# EAGLE schematic PCB-CMB-6 (EAGLE 7.2.0)

## Sheet 1 of 2
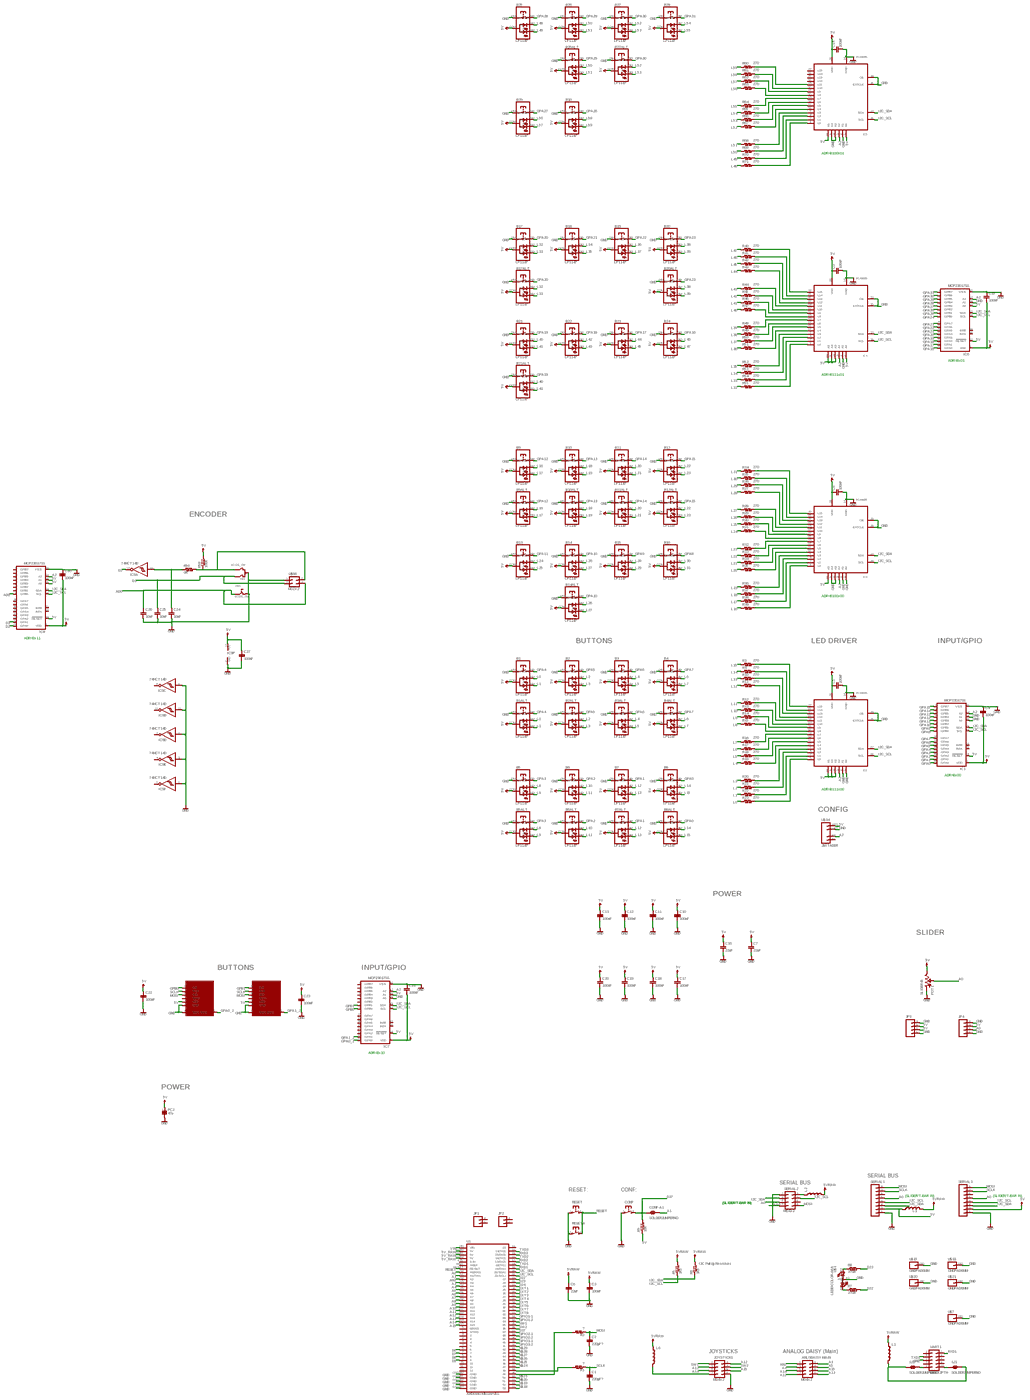
[diagram p0: schematic, sheet 1, overview]
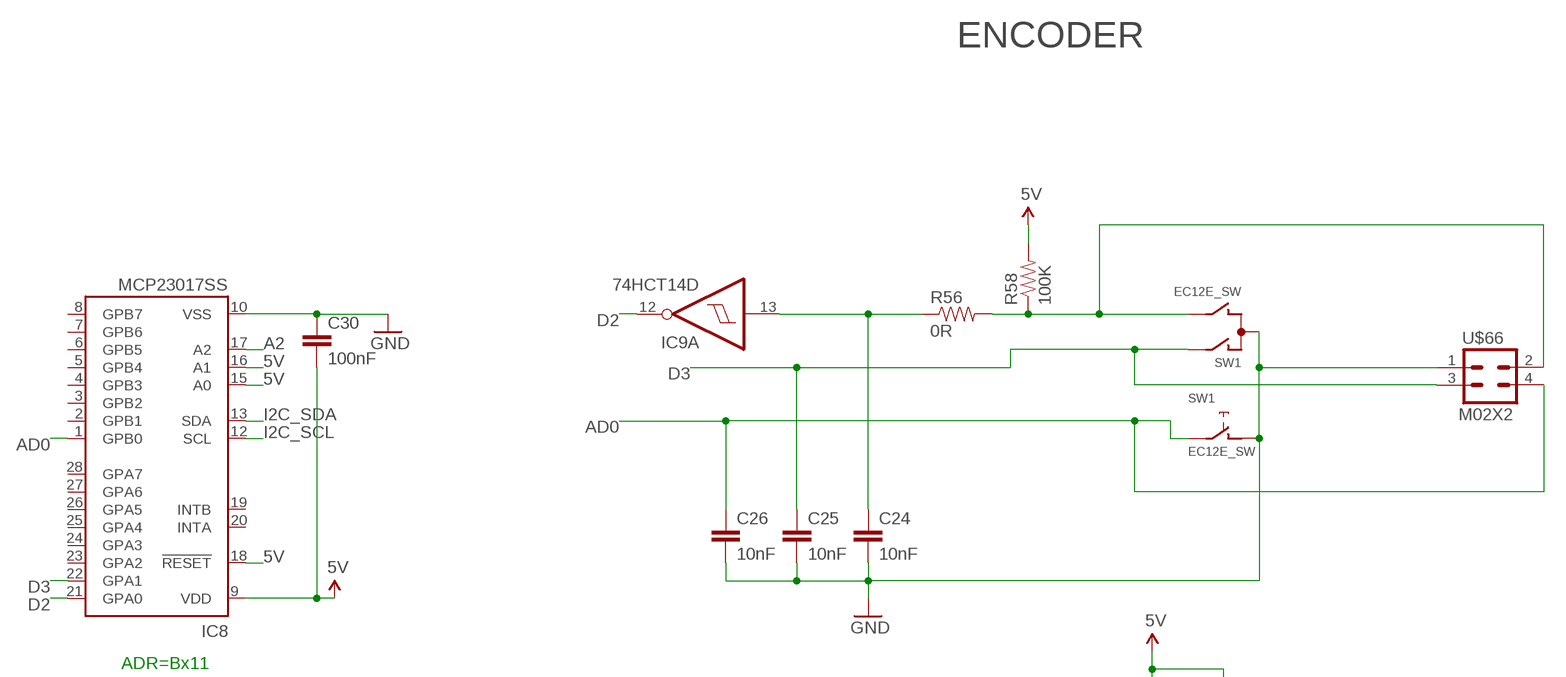
[diagram p1: schematic, sheet 1, part 1 of 6]
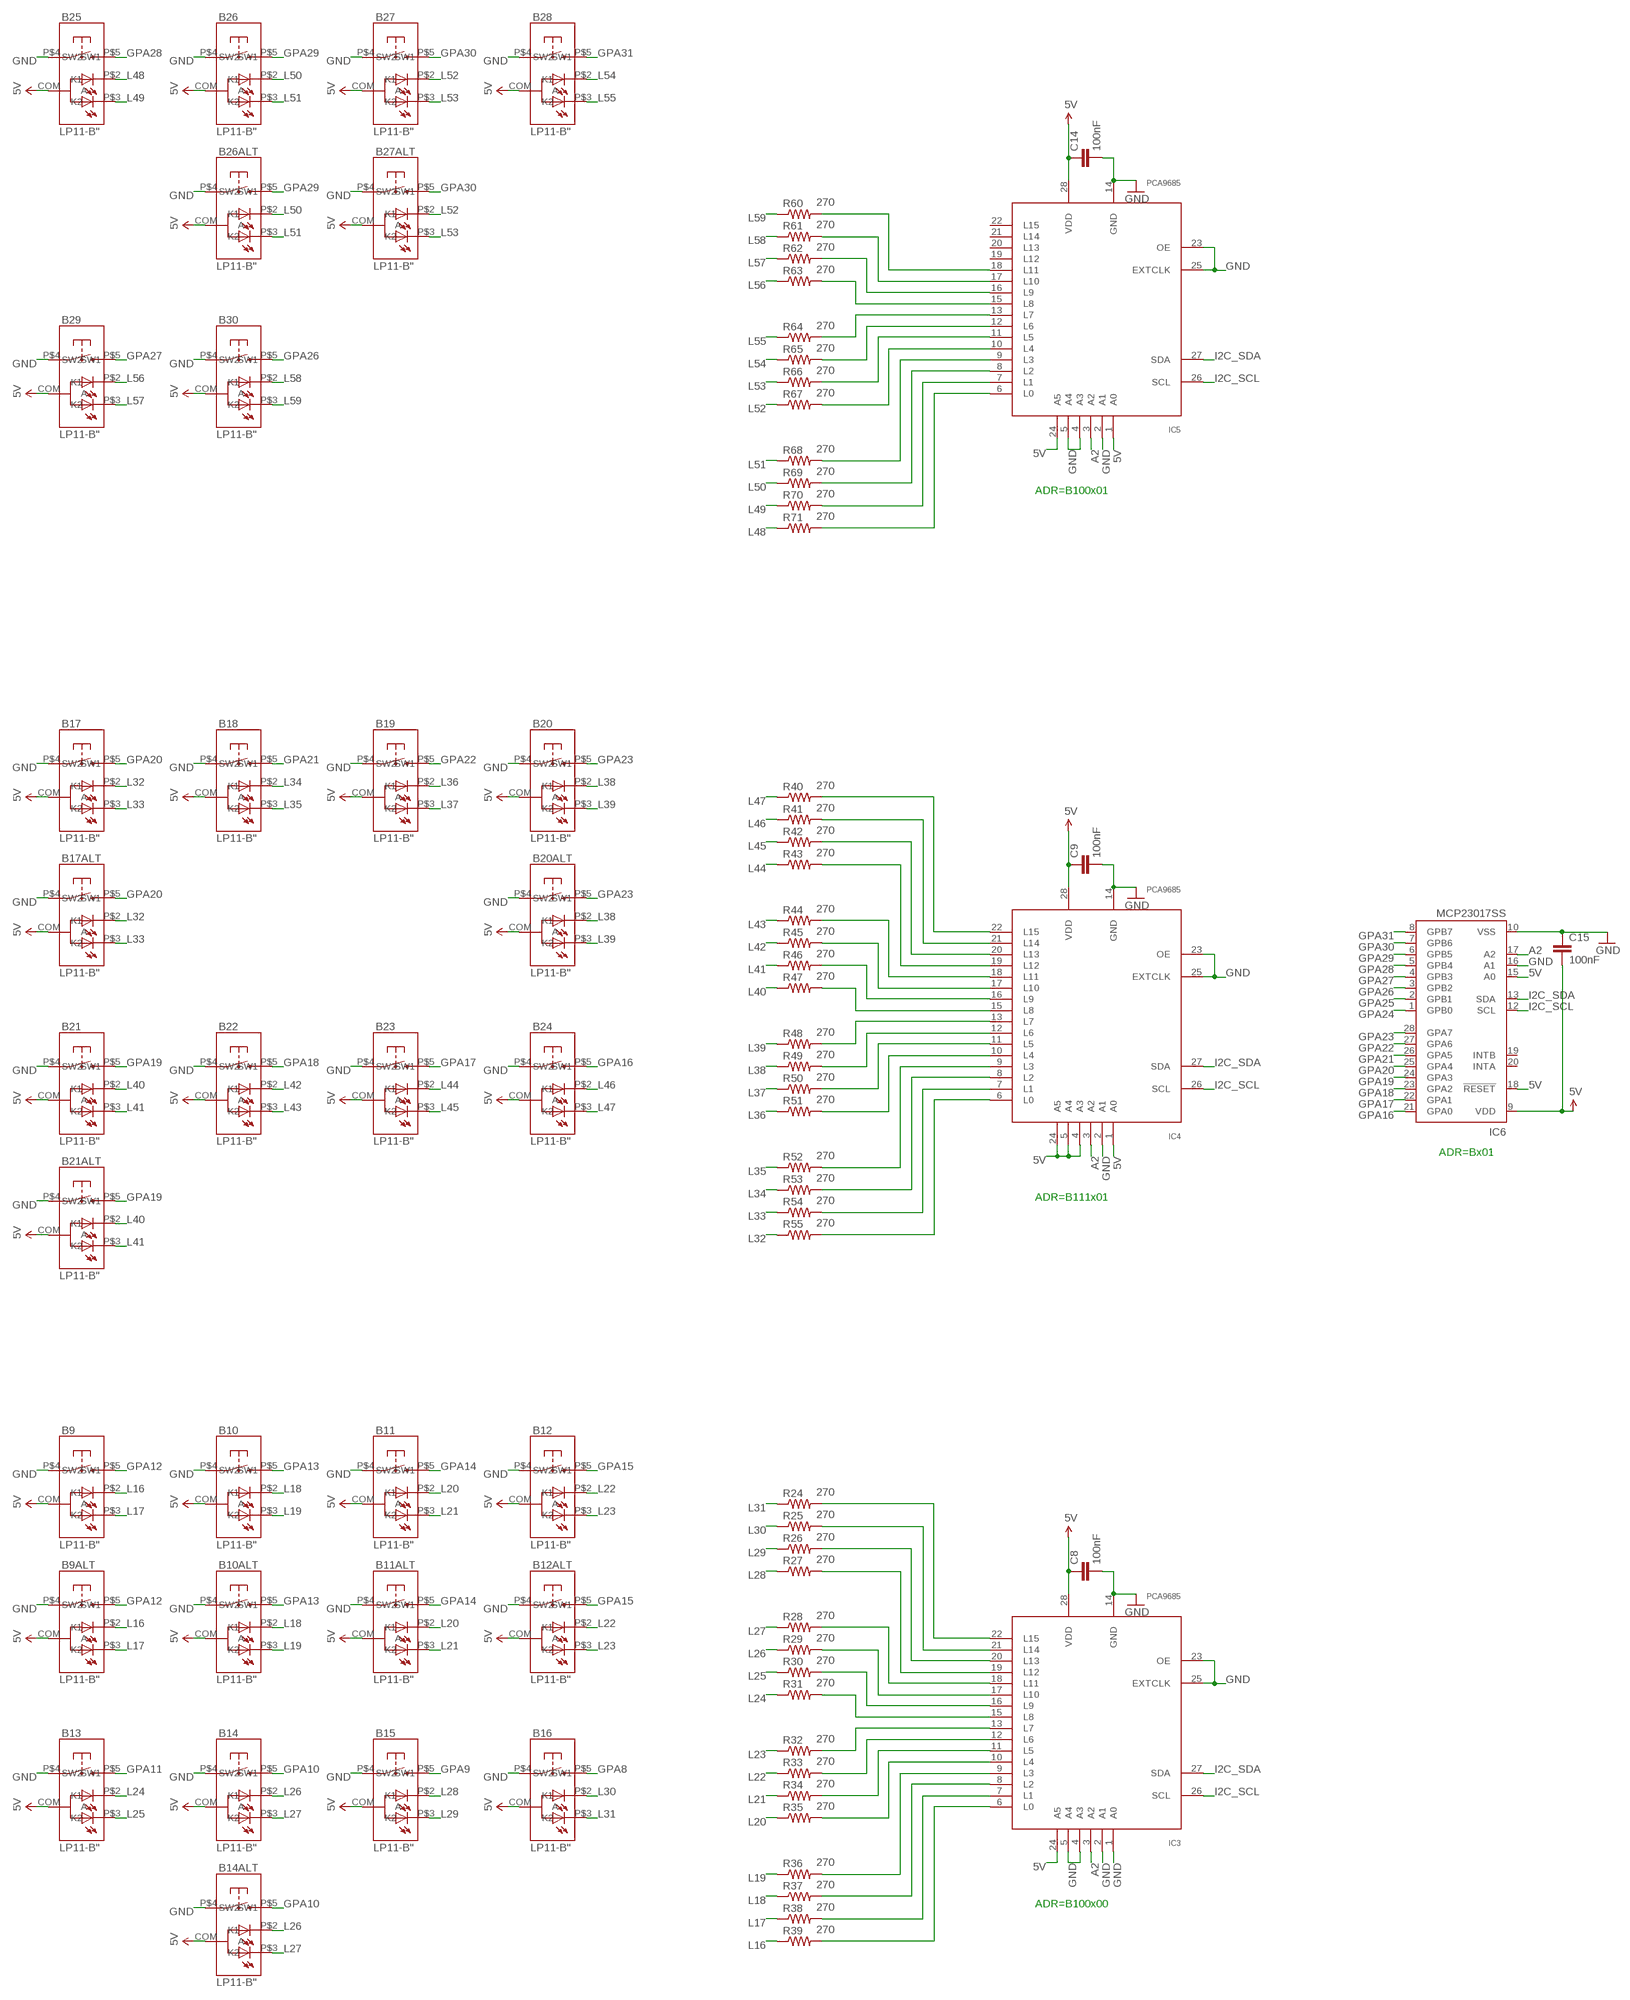
[diagram p2: schematic, sheet 1, part 2 of 6]
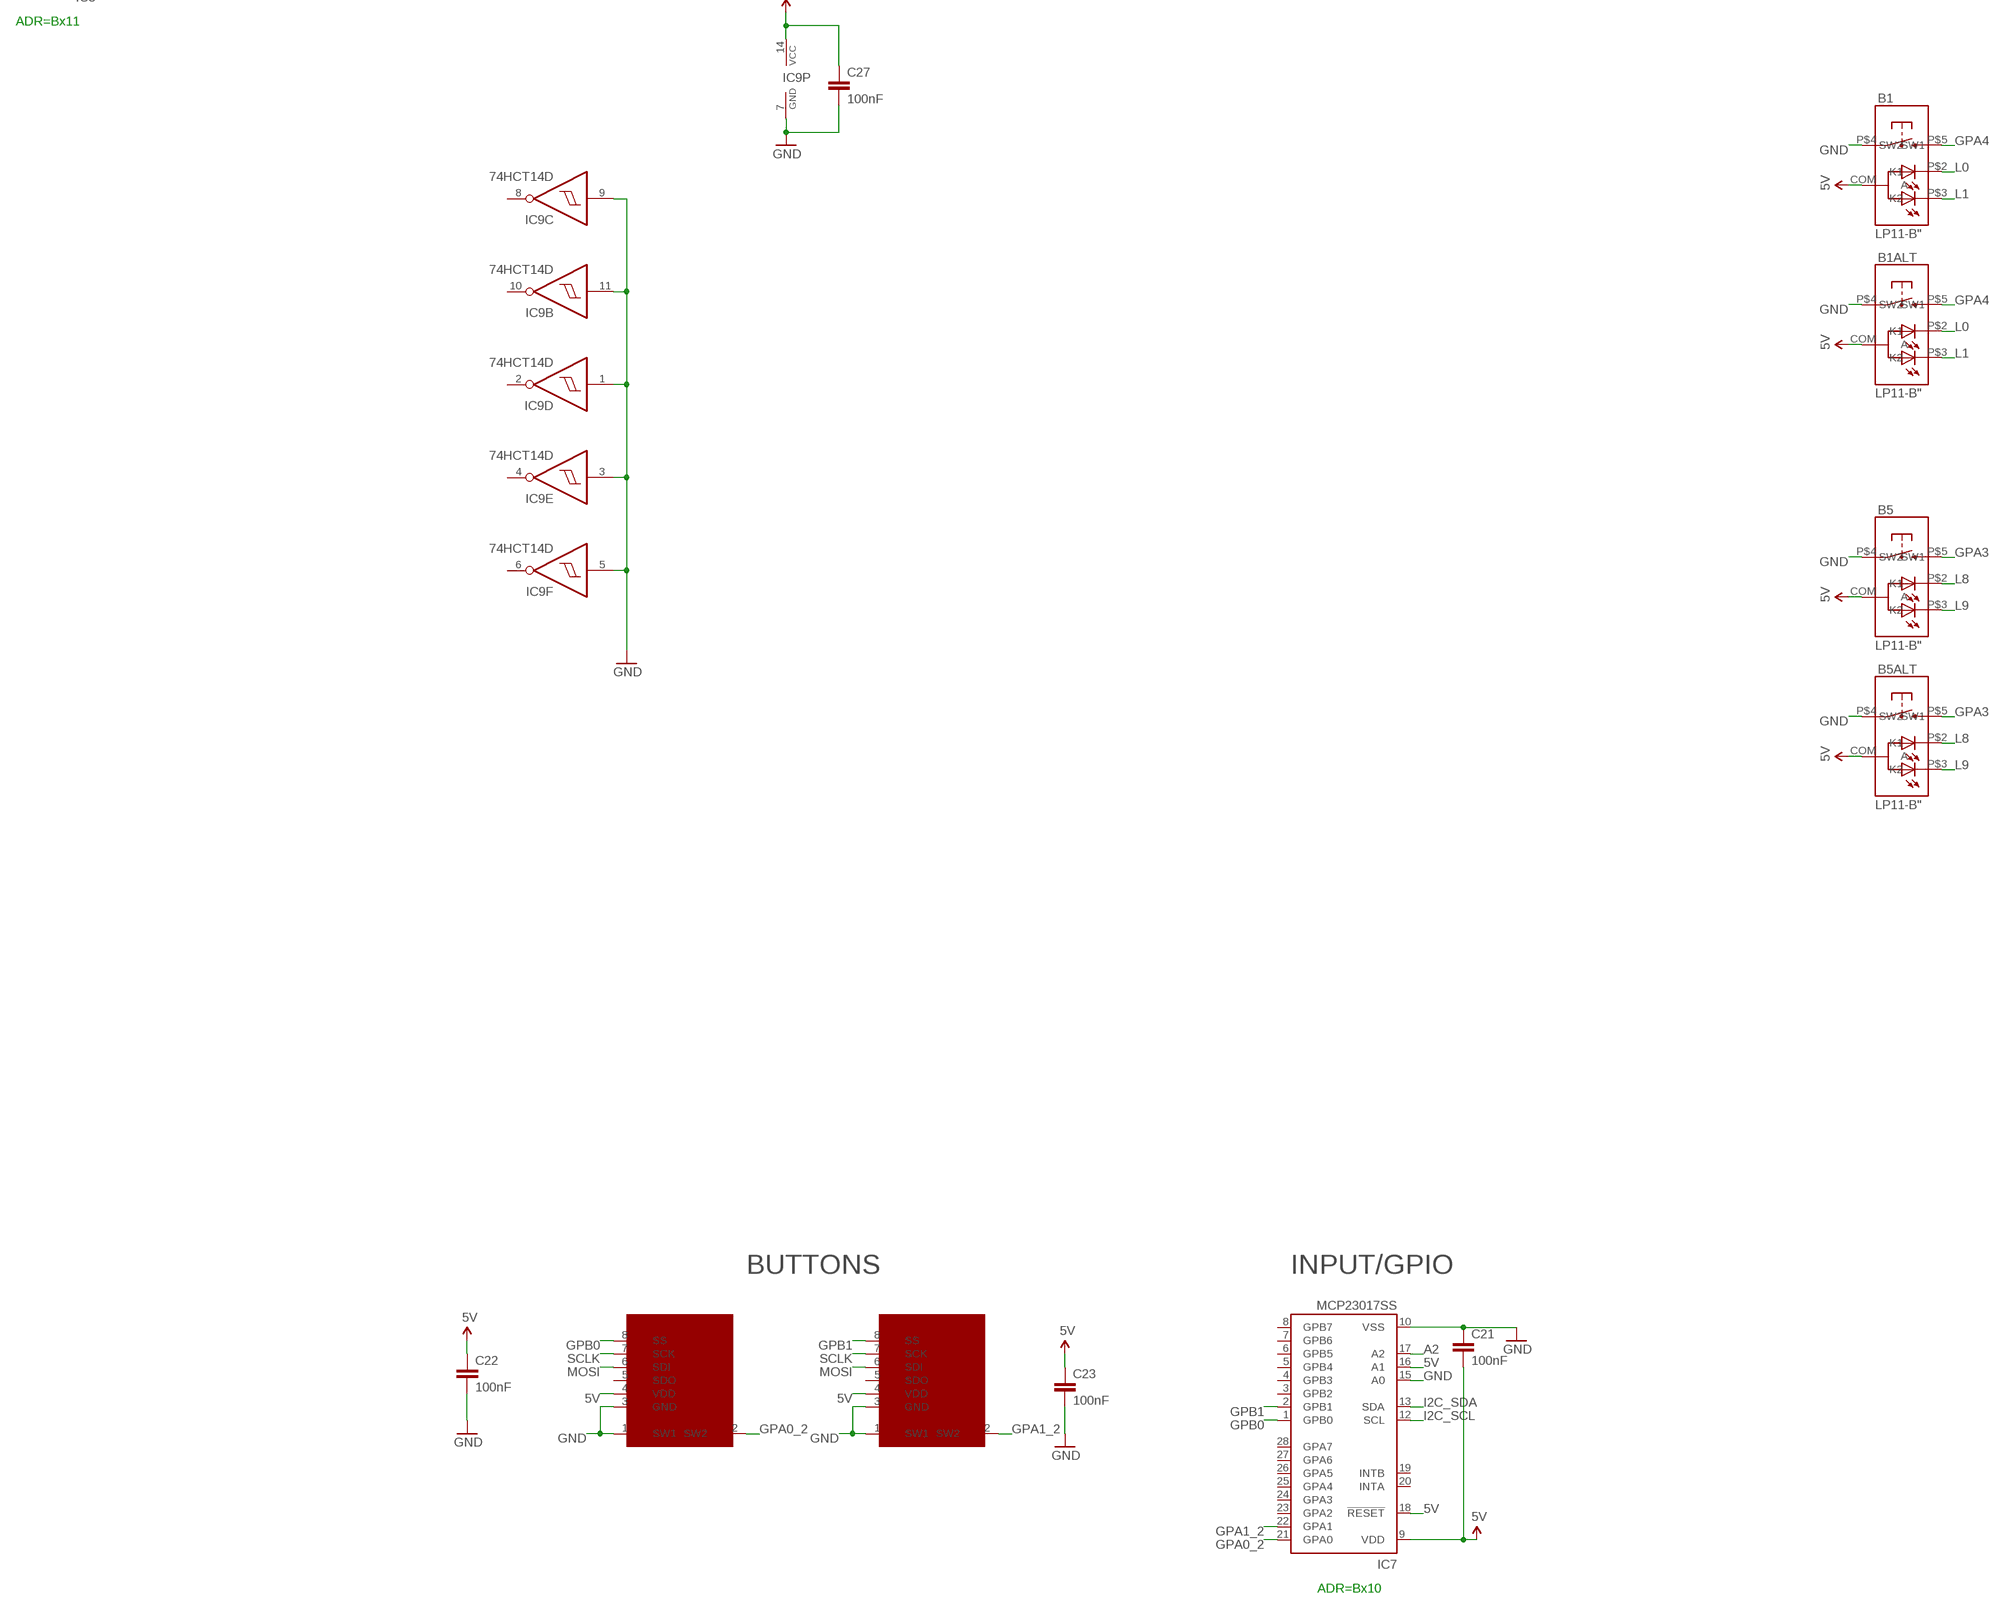
[diagram p3: schematic, sheet 1, part 3 of 6]
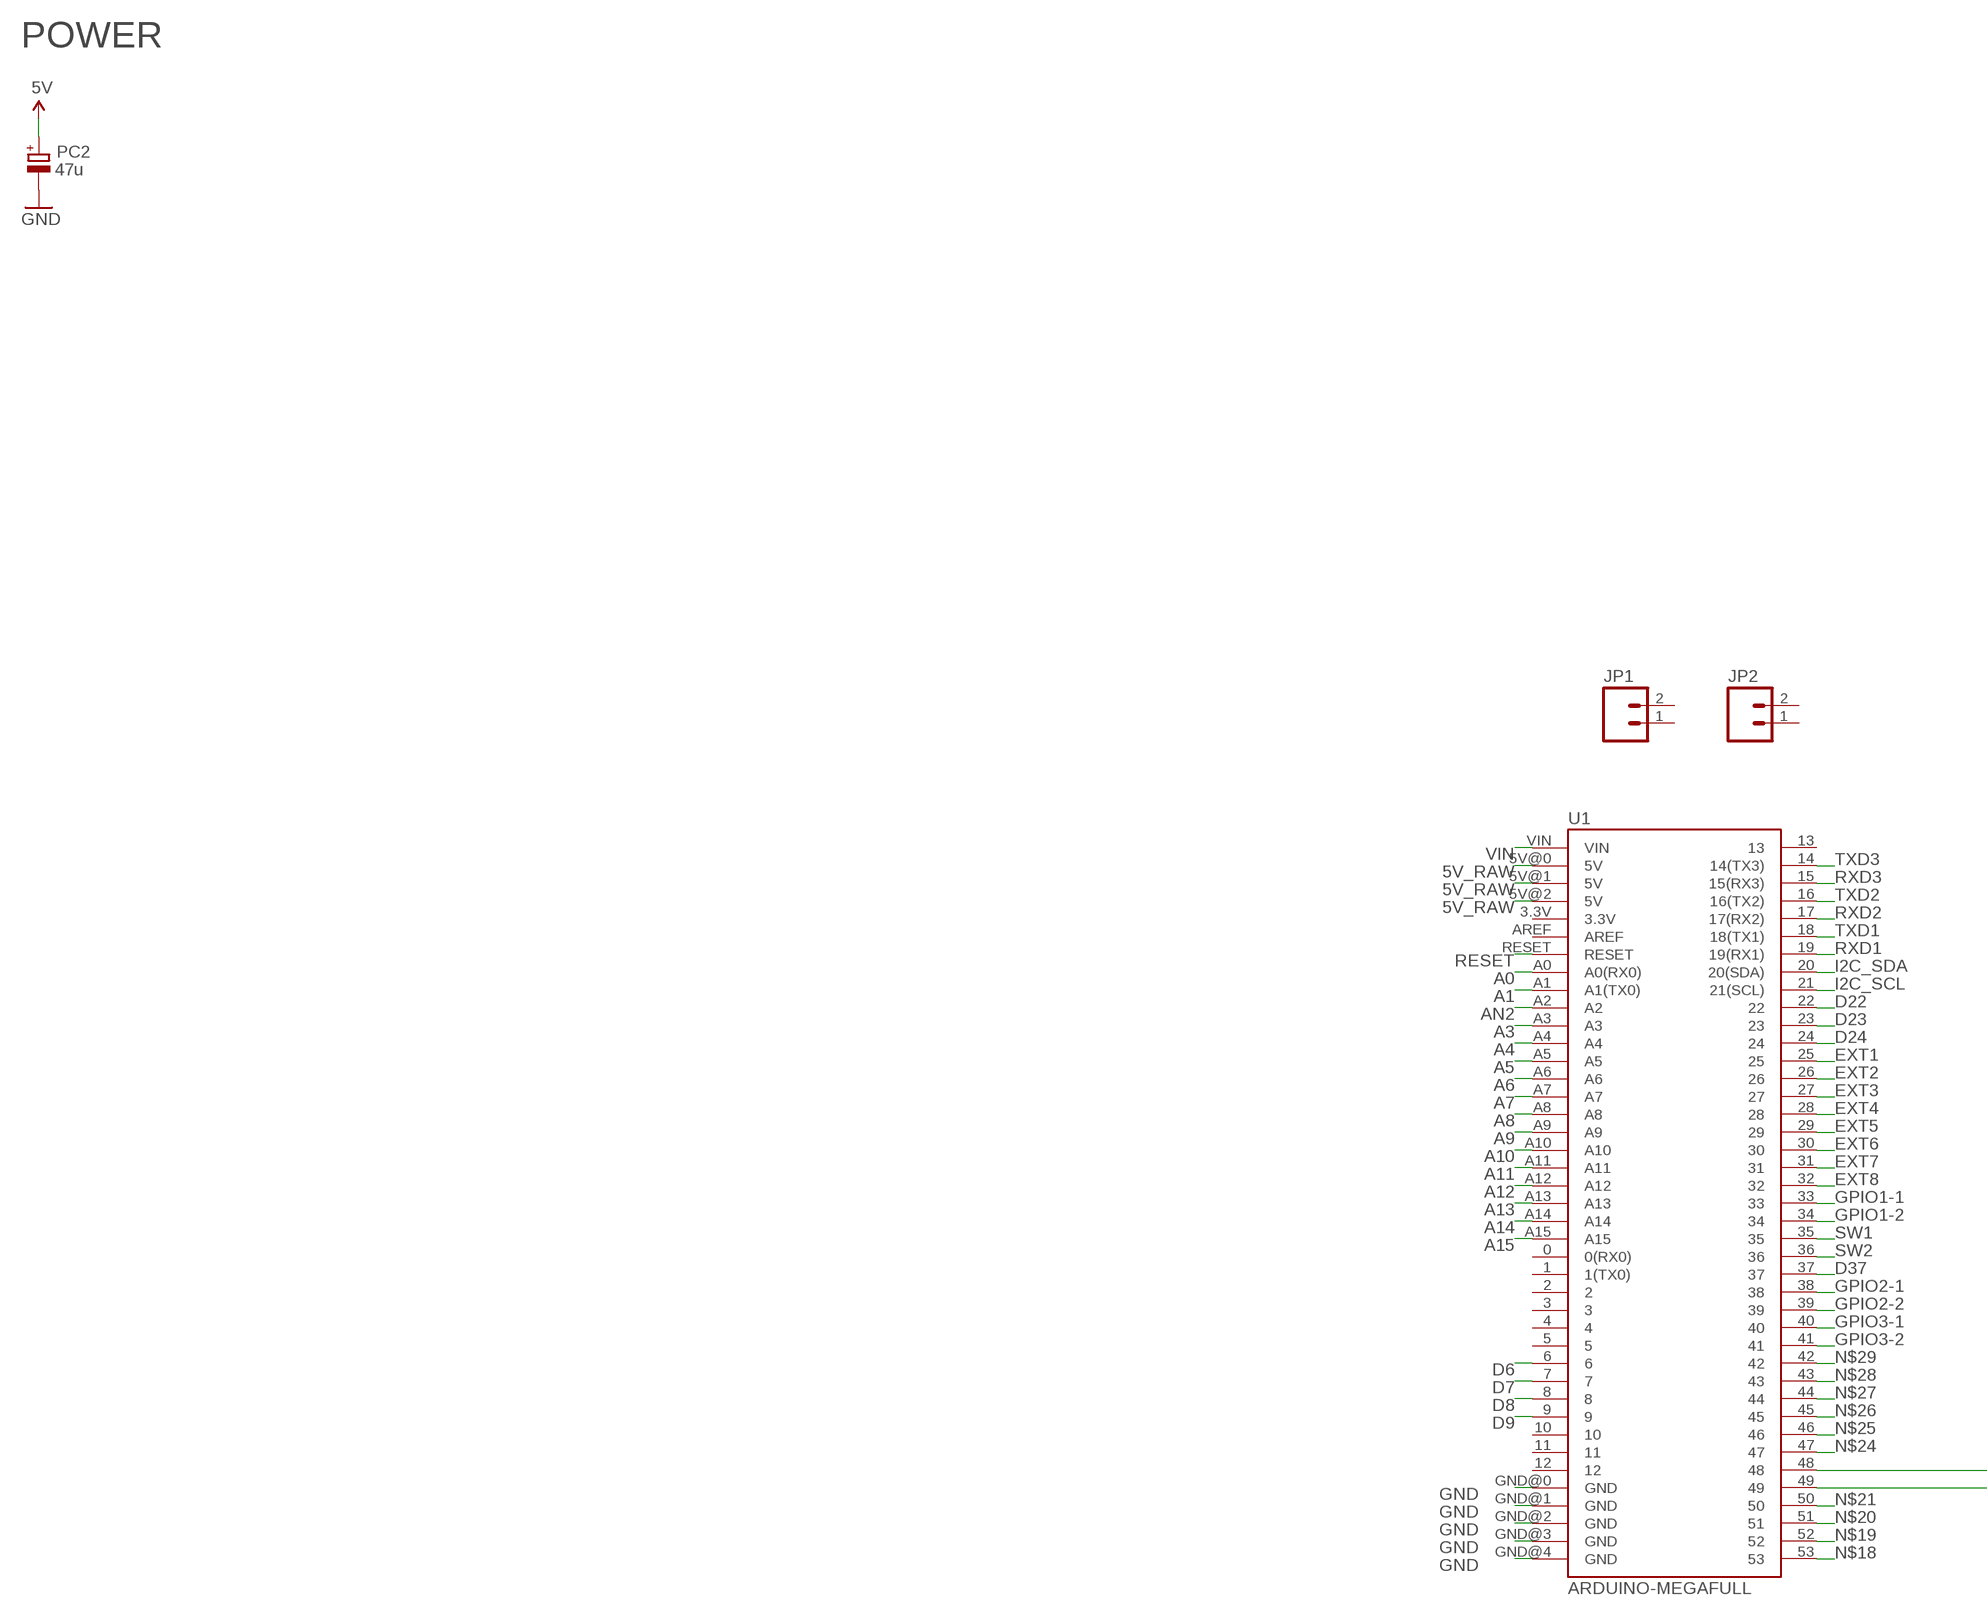
[diagram p4: schematic, sheet 1, part 4 of 6]
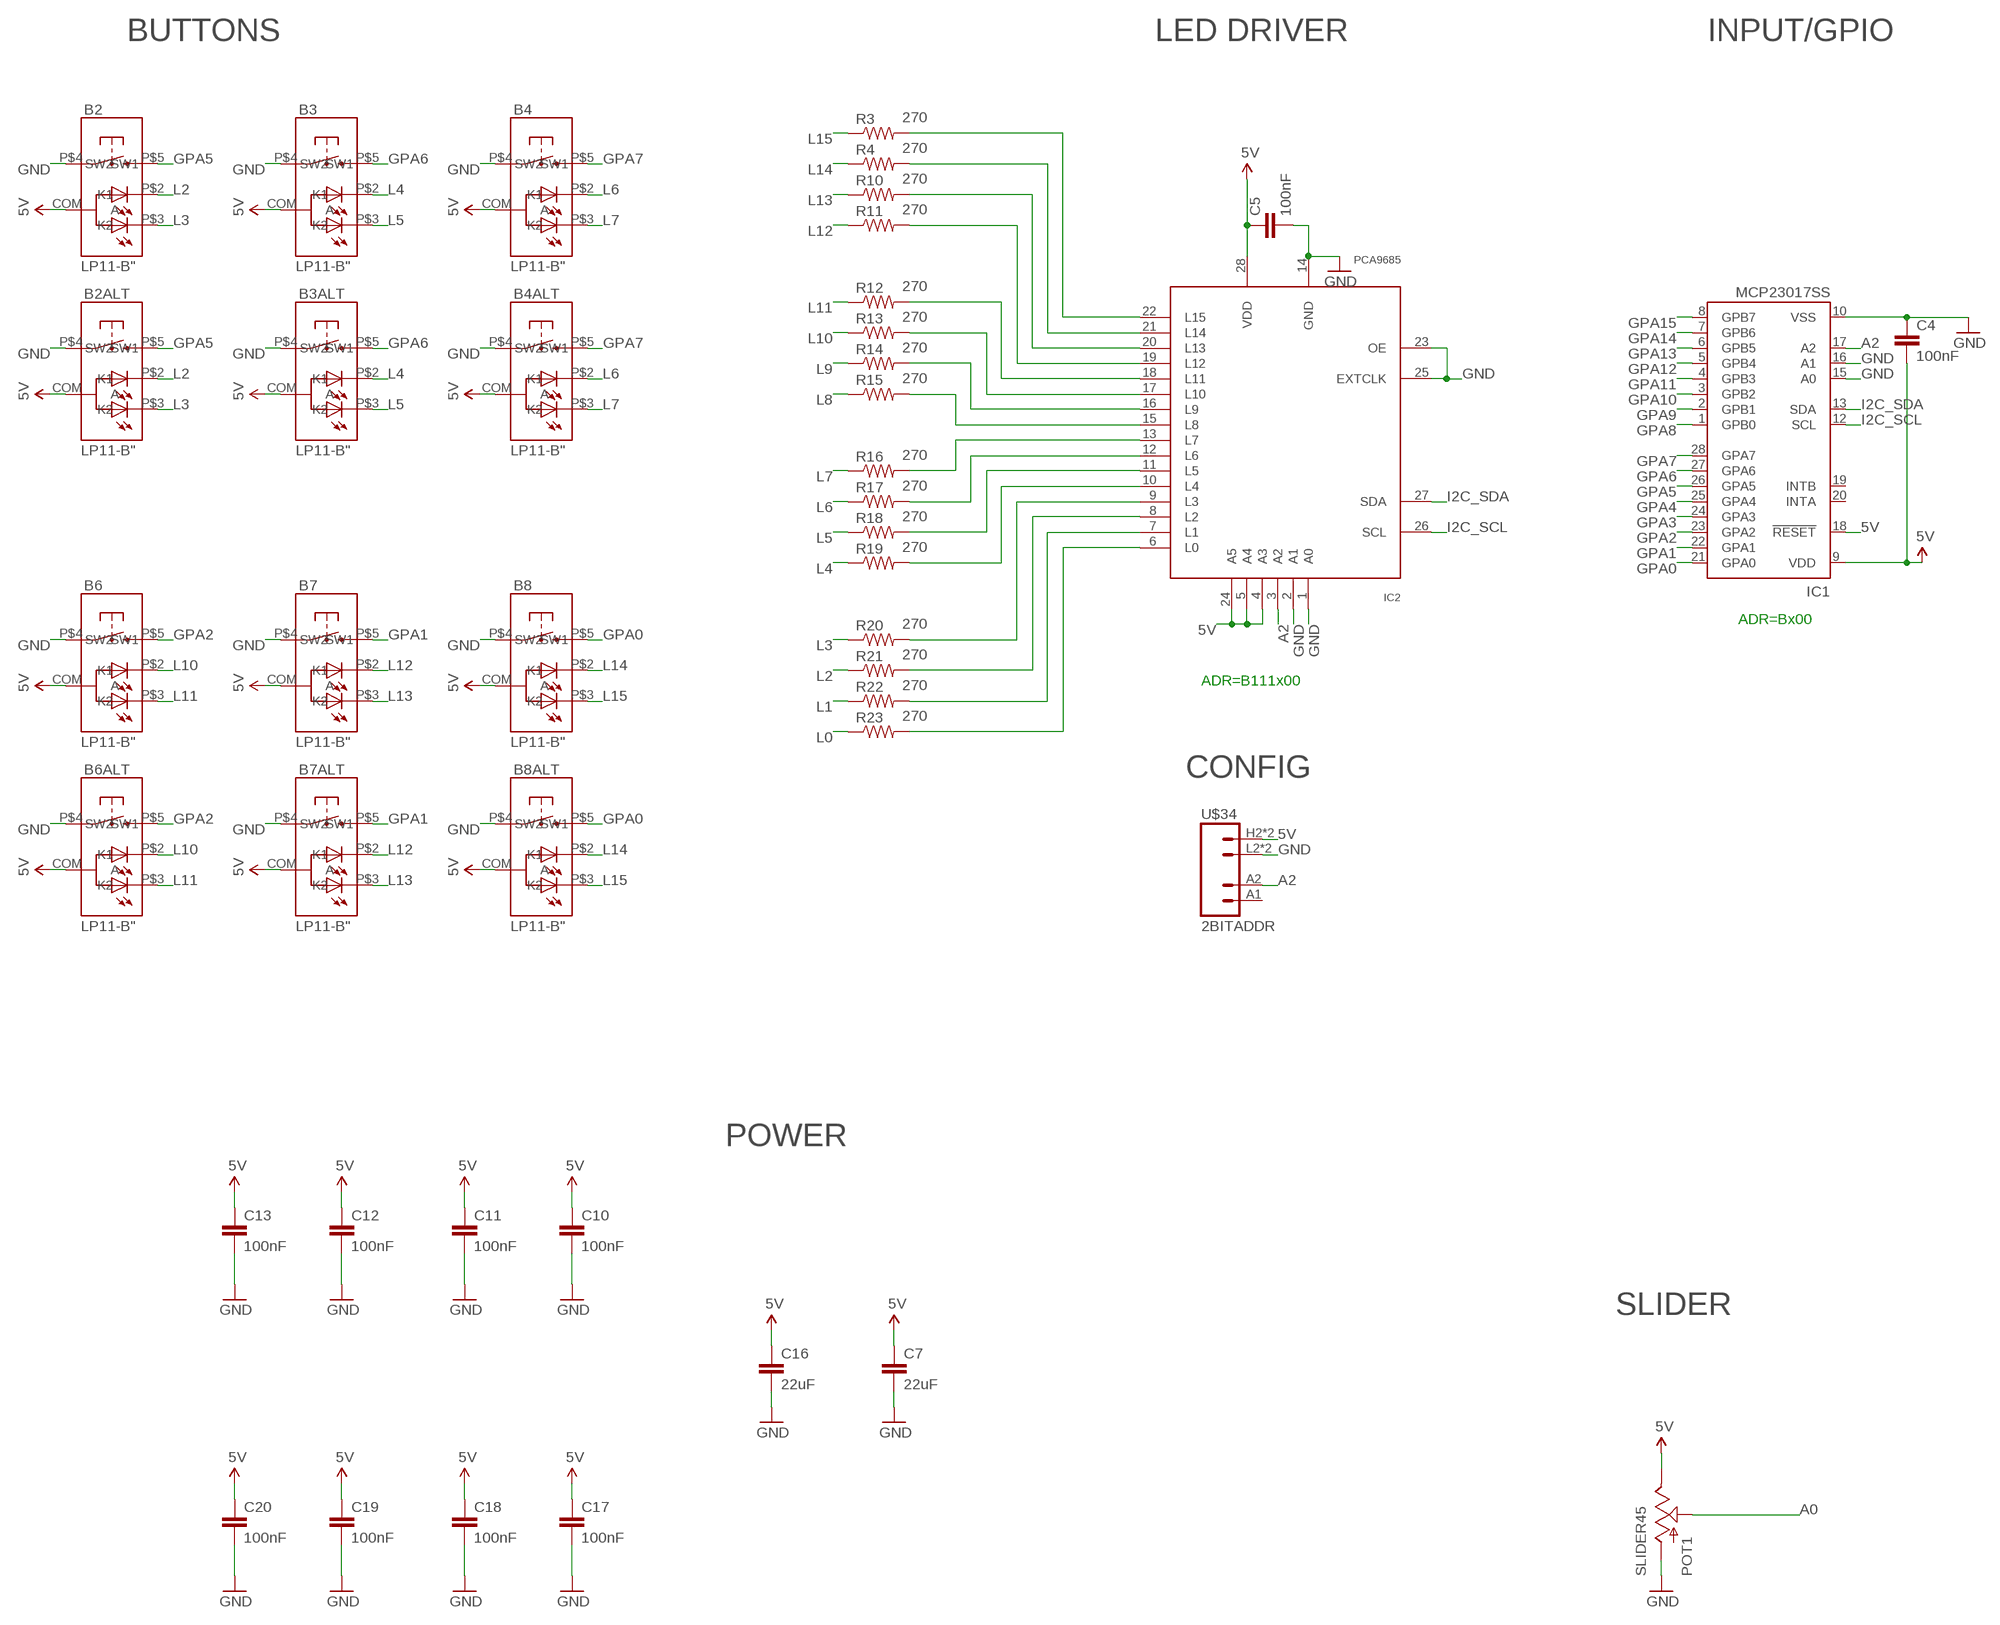
[diagram p5: schematic, sheet 1, part 5 of 6]
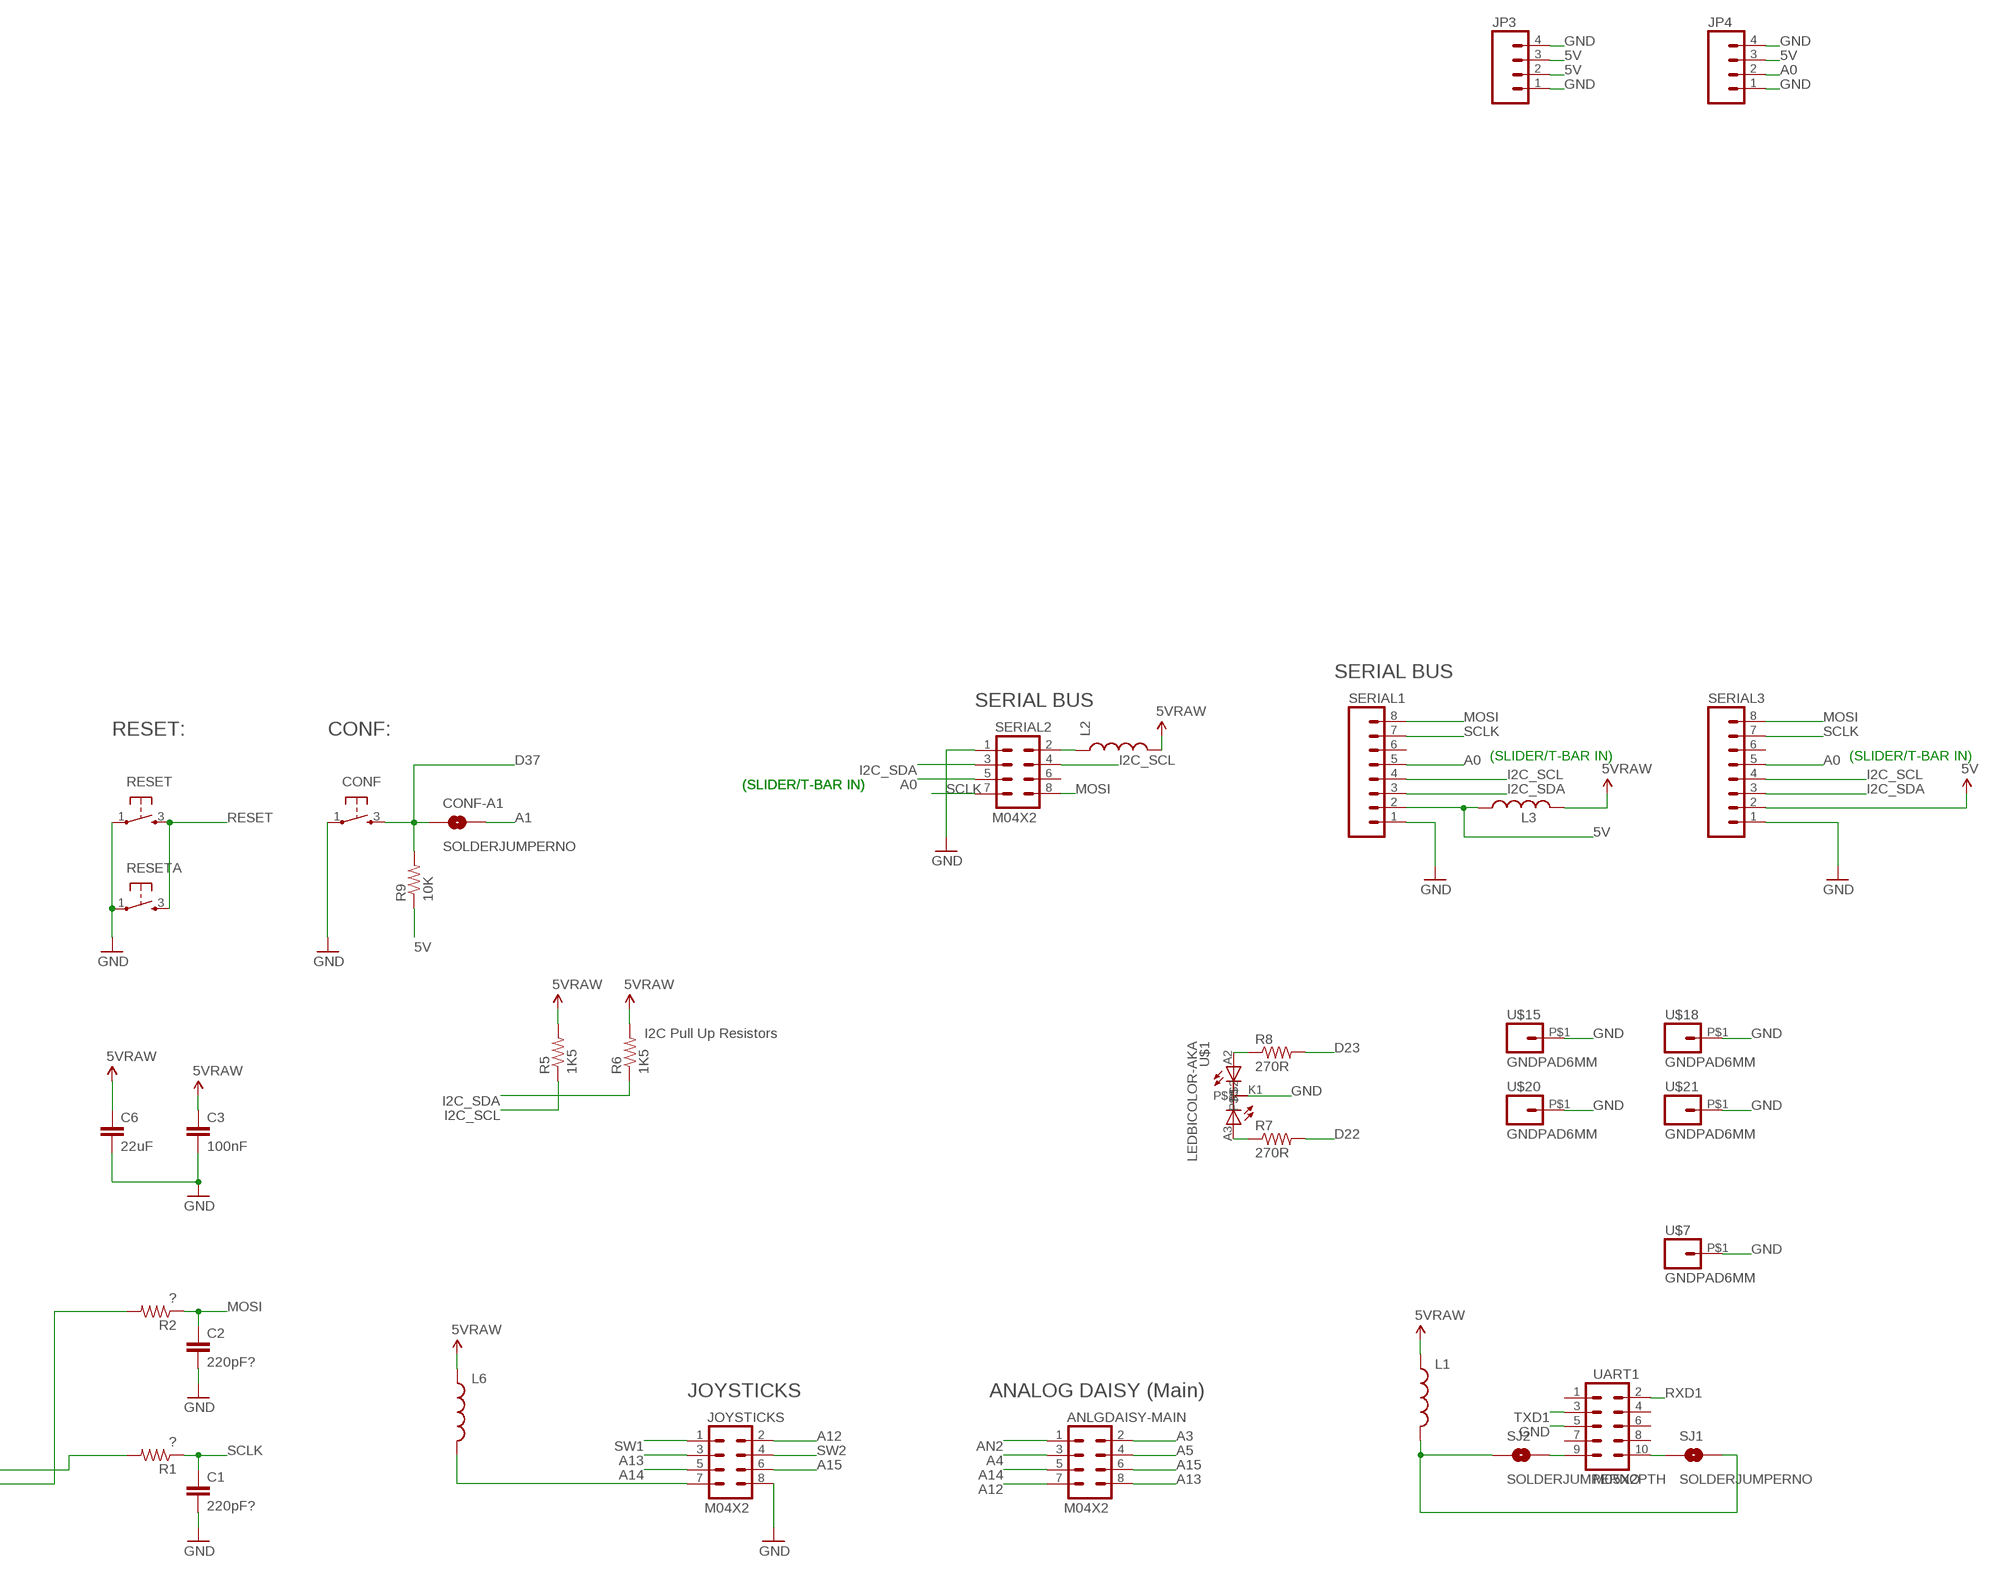
[diagram p6: schematic, sheet 1, part 6 of 6]

### Parts
ANLGDAISY-MAIN  M04X2  [2X4]
B1  LP11-B"  [LP11]
B1ALT  LP11-B"  [LP11]
B2  LP11-B"  [LP11]
B2ALT  LP11-B"  [LP11]
B3  LP11-B"  [LP11]
B3ALT  LP11-B"  [LP11]
B4  LP11-B"  [LP11]
B4ALT  LP11-B"  [LP11]
B5  LP11-B"  [LP11]
B5ALT  LP11-B"  [LP11]
B6  LP11-B"  [LP11]
B6ALT  LP11-B"  [LP11]
B7  LP11-B"  [LP11]
B7ALT  LP11-B"  [LP11]
B8  LP11-B"  [LP11]
B8ALT  LP11-B"  [LP11]
B9  LP11-B"  [LP11]
B9ALT  LP11-B"  [LP11]
B10  LP11-B"  [LP11]
B10ALT  LP11-B"  [LP11]
B11  LP11-B"  [LP11]
B11ALT  LP11-B"  [LP11]
B12  LP11-B"  [LP11]
B12ALT  LP11-B"  [LP11]
B13  LP11-B"  [LP11]
B14  LP11-B"  [LP11]
B14ALT  LP11-B"  [LP11]
B15  LP11-B"  [LP11]
B16  LP11-B"  [LP11]
B17  LP11-B"  [LP11]
B17ALT  LP11-B"  [LP11]
B18  LP11-B"  [LP11]
B19  LP11-B"  [LP11]
B20  LP11-B"  [LP11]
B20ALT  LP11-B"  [LP11]
B21  LP11-B"  [LP11]
B21ALT  LP11-B"  [LP11]
B22  LP11-B"  [LP11]
B23  LP11-B"  [LP11]
B24  LP11-B"  [LP11]
B25  LP11-B"  [LP11]
B26  LP11-B"  [LP11]
B26ALT  LP11-B"  [LP11]
B27  LP11-B"  [LP11]
B27ALT  LP11-B"  [LP11]
B28  LP11-B"  [LP11]
B29  LP11-B"  [LP11]
B30  LP11-B"  [LP11]
C1  220pF?  CAP0603-CAP  [0603-CAP]
C2  220pF?  CAP0603-CAP  [0603-CAP]
C3  100nF  CAP0603-CAP  [0603-CAP]
C4  100nF  CAP0603-CAP  [0603-CAP]
C5  100nF  CAP0603-CAP  [0603-CAP]
C6  22uF  CAP0805  [0805]
C7  22uF  CAP0805  [0805]
C8  100nF  CAP0603-CAP  [0603-CAP]
C9  100nF  CAP0603-CAP  [0603-CAP]
C10  100nF  CAP0603-CAP  [0603-CAP]
C11  100nF  CAP0603-CAP  [0603-CAP]
C12  100nF  CAP0603-CAP  [0603-CAP]
C13  100nF  CAP0603-CAP  [0603-CAP]
C14  100nF  CAP0603-CAP  [0603-CAP]
C15  100nF  CAP0603-CAP  [0603-CAP]
C16  22uF  CAP0805  [0805]
C17  100nF  CAP0603-CAP  [0603-CAP]
C18  100nF  CAP0603-CAP  [0603-CAP]
C19  100nF  CAP0603-CAP  [0603-CAP]
C20  100nF  CAP0603-CAP  [0603-CAP]
C21  100nF  CAP0603-CAP  [0603-CAP]
C22  100nF  CAP0603-CAP  [0603-CAP]
C23  100nF  CAP0603-CAP  [0603-CAP]
C24  10nF  CAP0603-CAP  [0603-CAP]
C25  10nF  CAP0603-CAP  [0603-CAP]
C26  10nF  CAP0603-CAP  [0603-CAP]
C27  100nF  CAP0603-CAP  [0603-CAP]
C30  100nF  CAP0603-CAP  [0603-CAP]
CONF  TAC_SWITCH  [PUSHBUTTON]
CONF-A1  SOLDERJUMPERNO  [SJ_2S-NO]
IC1  MCP23017SS  [SSOP28]
IC2  PCA9685  [TSSOP28]
IC3  PCA9685  [TSSOP28]
IC4  PCA9685  [TSSOP28]
IC5  PCA9685  [TSSOP28]
IC6  MCP23017SS  [SSOP28]
IC7  MCP23017SS  [SSOP28]
IC8  MCP23017SS  [SSOP28]
IC9  74HCT14D  [SO14]
JOYSTICKS  M04X2  [2X4]
JP1  M02PTH  [1X02]
JP2  M02PTH  [1X02]
JP3  M04PTH  [1X04]
JP4  M04PTH  [1X04]
L1  INDUCTOR0805  [0805]
L2  INDUCTOR0805  [0805]
L3  INDUCTOR0805  [0805]
L6  INDUCTOR0805  [0805]
PC2  47u  CPOL-EUD  [PANASONIC_D]
POT1  SLIDER45  [SLIDER45]
R1  ?  RESISTOR0603-RES  [0603-RES]
R2  ?  RESISTOR0603-RES  [0603-RES]
R3  270  RESISTOR0603-RES  [0603-RES]
R4  270  RESISTOR0603-RES  [0603-RES]
R5  1K5  RESISTOR0603-RES  [0603-RES]
R6  1K5  RESISTOR0603-RES  [0603-RES]
R7  270R  RESISTOR0603-RES  [0603-RES]
R8  270R  RESISTOR0603-RES  [0603-RES]
R9  10K  RESISTOR0603-RES  [0603-RES]
R10  270  RESISTOR0603-RES  [0603-RES]
R11  270  RESISTOR0603-RES  [0603-RES]
R12  270  RESISTOR0603-RES  [0603-RES]
R13  270  RESISTOR0603-RES  [0603-RES]
R14  270  RESISTOR0603-RES  [0603-RES]
R15  270  RESISTOR0603-RES  [0603-RES]
R16  270  RESISTOR0603-RES  [0603-RES]
R17  270  RESISTOR0603-RES  [0603-RES]
R18  270  RESISTOR0603-RES  [0603-RES]
R19  270  RESISTOR0603-RES  [0603-RES]
R20  270  RESISTOR0603-RES  [0603-RES]
R21  270  RESISTOR0603-RES  [0603-RES]
R22  270  RESISTOR0603-RES  [0603-RES]
R23  270  RESISTOR0603-RES  [0603-RES]
R24  270  RESISTOR0603-RES  [0603-RES]
R25  270  RESISTOR0603-RES  [0603-RES]
R26  270  RESISTOR0603-RES  [0603-RES]
R27  270  RESISTOR0603-RES  [0603-RES]
R28  270  RESISTOR0603-RES  [0603-RES]
R29  270  RESISTOR0603-RES  [0603-RES]
R30  270  RESISTOR0603-RES  [0603-RES]
R31  270  RESISTOR0603-RES  [0603-RES]
R32  270  RESISTOR0603-RES  [0603-RES]
R33  270  RESISTOR0603-RES  [0603-RES]
R34  270  RESISTOR0603-RES  [0603-RES]
R35  270  RESISTOR0603-RES  [0603-RES]
R36  270  RESISTOR0603-RES  [0603-RES]
R37  270  RESISTOR0603-RES  [0603-RES]
R38  270  RESISTOR0603-RES  [0603-RES]
R39  270  RESISTOR0603-RES  [0603-RES]
R40  270  RESISTOR0603-RES  [0603-RES]
R41  270  RESISTOR0603-RES  [0603-RES]
R42  270  RESISTOR0603-RES  [0603-RES]
R43  270  RESISTOR0603-RES  [0603-RES]
R44  270  RESISTOR0603-RES  [0603-RES]
R45  270  RESISTOR0603-RES  [0603-RES]
R46  270  RESISTOR0603-RES  [0603-RES]
R47  270  RESISTOR0603-RES  [0603-RES]
R48  270  RESISTOR0603-RES  [0603-RES]
R49  270  RESISTOR0603-RES  [0603-RES]
R50  270  RESISTOR0603-RES  [0603-RES]
R51  270  RESISTOR0603-RES  [0603-RES]
R52  270  RESISTOR0603-RES  [0603-RES]
R53  270  RESISTOR0603-RES  [0603-RES]
R54  270  RESISTOR0603-RES  [0603-RES]
R55  270  RESISTOR0603-RES  [0603-RES]
R56  0R  RESISTOR0603-RES  [0603-RES]
R58  100K  RESISTOR0603-RES  [0603-RES]
R60  270  RESISTOR0603-RES  [0603-RES]
R61  270  RESISTOR0603-RES  [0603-RES]
R62  270  RESISTOR0603-RES  [0603-RES]
R63  270  RESISTOR0603-RES  [0603-RES]
R64  270  RESISTOR0603-RES  [0603-RES]
R65  270  RESISTOR0603-RES  [0603-RES]
R66  270  RESISTOR0603-RES  [0603-RES]
R67  270  RESISTOR0603-RES  [0603-RES]
R68  270  RESISTOR0603-RES  [0603-RES]
R69  270  RESISTOR0603-RES  [0603-RES]
R70  270  RESISTOR0603-RES  [0603-RES]
R71  270  RESISTOR0603-RES  [0603-RES]
RESET  TAC_SWITCH  [PUSHBUTTON]
RESETA  TAC_SWITCH  [PUSHBUTTON]
SERIAL1  M081X08  [1X08]
SERIAL2  M04X2  [2X4]
SERIAL3  M081X08  [1X08]
SJ1  SOLDERJUMPERNO  [SJ_2S-NO]
SJ2  SOLDERJUMPERNO  [SJ_2S-NO]
SSW1  SMART_SWITCHSMART_SWITCH_8PIN  [SMART_SWITCH]
SSW2  SMART_SWITCHSMART_SWITCH_8PIN  [SMART_SWITCH]
SW1  EC12E_SW  [ALPS_EC12E_SW]
U1  ARDUINO-MEGAFULL  [ARDUINO_MEGA]
U$1  LEDBICOLOR-AKA  [LED5MM-BICOLOR]
U$7  GNDPAD6MM  [3.2MMPAD6MM]
U$15  GNDPAD6MM  [3.2MMPAD6MM]
U$18  GNDPAD6MM  [3.2MMPAD6MM]
U$20  GNDPAD6MM  [3.2MMPAD6MM]
U$21  GNDPAD6MM  [3.2MMPAD6MM]
U$34  2BITADDR  [2BITADDR]
U$66  M02X2  [2X2]
UART1  M05X2PTH  [AVR_ICSP]

### Nets
5V [Power]: B1.COM(A) B1ALT.COM(A) B2.COM(A) B2ALT.COM(A) B3.COM(A) B3ALT.COM(A) B4.COM(A) B4ALT.COM(A) B5.COM(A) B5ALT.COM(A) B6.COM(A) B6ALT.COM(A) B7.COM(A) B7ALT.COM(A) B8.COM(A) B8ALT.COM(A) B9.COM(A) B9ALT.COM(A) B10.COM(A) B10ALT.COM(A) B11.COM(A) B11ALT.COM(A) B12.COM(A) B12ALT.COM(A) B13.COM(A) B14.COM(A) B14ALT.COM(A) B15.COM(A) B16.COM(A) B17.COM(A) B17ALT.COM(A) B18.COM(A) B19.COM(A) B20.COM(A) B20ALT.COM(A) B21.COM(A) B21ALT.COM(A) B22.COM(A) B23.COM(A) B24.COM(A) B25.COM(A) B26.COM(A) B26ALT.COM(A) B27.COM(A) B27ALT.COM(A) B28.COM(A) B29.COM(A) B30.COM(A) C4.2 C5.1 C7.1 C8.1 C9.1 C10.1 C11.1 C12.1 C13.1 C14.1 C15.2 C16.1 C17.1 C18.1 C19.1 C20.1 C21.2 C22.1 C23.1 C27.1 C30.2 IC1.9(VDD) IC1.18(!RESET) IC2.4(A3) IC2.5(A4) IC2.24(A5) IC2.28(VDD) IC3.24(A5) IC3.28(VDD) IC4.1(A0) IC4.4(A3) IC4.5(A4) IC4.24(A5) IC4.28(VDD) IC5.1(A0) IC5.24(A5) IC5.28(VDD) IC6.9(VDD) IC6.15(A0) IC6.18(!RESET) IC7.9(VDD) IC7.16(A1) IC7.18(!RESET) IC8.9(VDD) IC8.15(A0) IC8.16(A1) IC8.18(!RESET) IC9.14(P:VCC) JP3.2 JP3.3 JP4.3 L3.1 PC2.+ POT1.1(E) R9.1 R58.2 SERIAL1.2 SERIAL3.2 SSW1.4(VDD) SSW2.4(VDD) U$34.H2(VCC) U$34.H3(VCC)
5V_RAW [Power]: C3.1 C6.1 L1.1 L2.2 L3.2 L6.1 R5.2 R6.2 U1.5V@0(5V) U1.5V@1(5V) U1.5V@2(5V) ; supply symbol labelled 5VRAW
A0: JP4.2 POT1.2A(S) SERIAL1.5 SERIAL2.5 SERIAL3.5 U1.A0(A0(RX0))
A1: CONF-A1.2 U1.A1(A1(TX0))
A2: IC1.17(A2) IC2.3(A2) IC3.3(A2) IC4.3(A2) IC5.3(A2) IC6.17(A2) IC7.17(A2) IC8.17(A2) U$34.A2
A3: ANLGDAISY-MAIN.2 U1.A3
A4: ANLGDAISY-MAIN.3 U1.A4
A5: ANLGDAISY-MAIN.4 U1.A5
A6: U1.A6
A7: U1.A7
A8: U1.A8
A9: U1.A9
A10: U1.A10
A11: U1.A11
A12: ANLGDAISY-MAIN.7 JOYSTICKS.2 U1.A12
A13: ANLGDAISY-MAIN.8 JOYSTICKS.3 U1.A13
A14: ANLGDAISY-MAIN.5 JOYSTICKS.5 U1.A14
A15: ANLGDAISY-MAIN.6 JOYSTICKS.6 U1.A15
AD0: C26.1 IC8.1(GPB0) SW1.E U$66.4
AN2: ANLGDAISY-MAIN.1 U1.A2
D2: IC8.21(GPA0) IC9.12(A:O)
D3: C25.1 IC8.22(GPA1) SW1.A U$66.3
D6: U1.6
D7: U1.7
D8: U1.8
D9: U1.9
D22: R7.2 U1.22
D23: R8.2 U1.23
D24: U1.24
D37: CONF-A1.1 CONF.3 R9.2 U1.37
EXT1: U1.25
EXT2: U1.26
EXT3: U1.27
EXT4: U1.28
EXT5: U1.29
EXT6: U1.30
EXT7: U1.31
EXT8: U1.32
GND [Power]: B1.P$4(SW1) B1ALT.P$4(SW1) B2.P$4(SW1) B2ALT.P$4(SW1) B3.P$4(SW1) B3ALT.P$4(SW1) B4.P$4(SW1) B4ALT.P$4(SW1) B5.P$4(SW1) B5ALT.P$4(SW1) B6.P$4(SW1) B6ALT.P$4(SW1) B7.P$4(SW1) B7ALT.P$4(SW1) B8.P$4(SW1) B8ALT.P$4(SW1) B9.P$4(SW1) B9ALT.P$4(SW1) B10.P$4(SW1) B10ALT.P$4(SW1) B11.P$4(SW1) B11ALT.P$4(SW1) B12.P$4(SW1) B12ALT.P$4(SW1) B13.P$4(SW1) B14.P$4(SW1) B14ALT.P$4(SW1) B15.P$4(SW1) B16.P$4(SW1) B17.P$4(SW1) B17ALT.P$4(SW1) B18.P$4(SW1) B19.P$4(SW1) B20.P$4(SW1) B20ALT.P$4(SW1) B21.P$4(SW1) B21ALT.P$4(SW1) B22.P$4(SW1) B23.P$4(SW1) B24.P$4(SW1) B25.P$4(SW1) B26.P$4(SW1) B26ALT.P$4(SW1) B27.P$4(SW1) B27ALT.P$4(SW1) B28.P$4(SW1) B29.P$4(SW1) B30.P$4(SW1) C1.2 C2.2 C3.2 C4.1 C5.2 C6.2 C7.2 C8.2 C9.2 C10.2 C11.2 C12.2 C13.2 C14.2 C15.1 C16.2 C17.2 C18.2 C19.2 C20.2 C21.1 C22.2 C23.2 C24.2 C25.2 C26.2 C27.2 C30.1 CONF.1 IC1.10(VSS) IC1.15(A0) IC1.16(A1) IC2.1(A0) IC2.2(A1) IC2.14(GND) IC2.23(OE) IC2.25(EXTCLK) IC3.1(A0) IC3.2(A1) IC3.4(A3) IC3.5(A4) IC3.14(GND) IC3.23(OE) IC3.25(EXTCLK) IC4.2(A1) IC4.14(GND) IC4.23(OE) IC4.25(EXTCLK) IC5.2(A1) IC5.4(A3) IC5.5(A4) IC5.14(GND) IC5.23(OE) IC5.25(EXTCLK) IC6.10(VSS) IC6.16(A1) IC7.10(VSS) IC7.15(A0) IC8.10(VSS) IC9.1(D:I) IC9.3(E:I) IC9.5(F:I) IC9.7(P:GND) IC9.9(C:I) IC9.11(B:I) JOYSTICKS.8 JP3.1 JP3.4 JP4.1 JP4.4 PC2.- POT1.3(A) RESET.1 RESETA.1 SERIAL1.1 SERIAL2.1 SERIAL3.1 SSW1.1(SW1) SSW1.3(GND) SSW2.1(SW1) SSW2.3(GND) SW1.C SW1.D U1.GND@0(GND) U1.GND@1(GND) U1.GND@2(GND) U1.GND@3(GND) U1.GND@4(GND) U$1.K1 U$7.P$1 U$15.P$1 U$18.P$1 U$20.P$1 U$21.P$1 U$34.L2(GND) U$34.L3(GND) U$66.1 UART1.5
GPA0: B8.P$5(SW2) B8ALT.P$5(SW2) IC1.21(GPA0)
GPA0_2: IC7.21(GPA0) SSW1.2(SW2)
GPA1: B7.P$5(SW2) B7ALT.P$5(SW2) IC1.22(GPA1)
GPA1_2: IC7.22(GPA1) SSW2.2(SW2)
GPA2: B6.P$5(SW2) B6ALT.P$5(SW2) IC1.23(GPA2)
GPA3: B5.P$5(SW2) B5ALT.P$5(SW2) IC1.24(GPA3)
GPA4: B1.P$5(SW2) B1ALT.P$5(SW2) IC1.25(GPA4)
GPA5: B2.P$5(SW2) B2ALT.P$5(SW2) IC1.26(GPA5)
GPA6: B3.P$5(SW2) B3ALT.P$5(SW2) IC1.27(GPA6)
GPA7: B4.P$5(SW2) B4ALT.P$5(SW2) IC1.28(GPA7)
GPA8: B16.P$5(SW2) IC1.1(GPB0)
GPA9: B15.P$5(SW2) IC1.2(GPB1)
GPA10: B14.P$5(SW2) B14ALT.P$5(SW2) IC1.3(GPB2)
GPA11: B13.P$5(SW2) IC1.4(GPB3)
GPA12: B9.P$5(SW2) B9ALT.P$5(SW2) IC1.5(GPB4)
GPA13: B10.P$5(SW2) B10ALT.P$5(SW2) IC1.6(GPB5)
GPA14: B11.P$5(SW2) B11ALT.P$5(SW2) IC1.7(GPB6)
GPA15: B12.P$5(SW2) B12ALT.P$5(SW2) IC1.8(GPB7)
GPA16: B24.P$5(SW2) IC6.21(GPA0)
GPA17: B23.P$5(SW2) IC6.22(GPA1)
GPA18: B22.P$5(SW2) IC6.23(GPA2)
GPA19: B21.P$5(SW2) B21ALT.P$5(SW2) IC6.24(GPA3)
GPA20: B17.P$5(SW2) B17ALT.P$5(SW2) IC6.25(GPA4)
GPA21: B18.P$5(SW2) IC6.26(GPA5)
GPA22: B19.P$5(SW2) IC6.27(GPA6)
GPA23: B20.P$5(SW2) B20ALT.P$5(SW2) IC6.28(GPA7)
GPA24: IC6.1(GPB0)
GPA25: IC6.2(GPB1)
GPA26: B30.P$5(SW2) IC6.3(GPB2)
GPA27: B29.P$5(SW2) IC6.4(GPB3)
GPA28: B25.P$5(SW2) IC6.5(GPB4)
GPA29: B26.P$5(SW2) B26ALT.P$5(SW2) IC6.6(GPB5)
GPA30: B27.P$5(SW2) B27ALT.P$5(SW2) IC6.7(GPB6)
GPA31: B28.P$5(SW2) IC6.8(GPB7)
GPB0: IC7.1(GPB0) SSW1.8(SS)
GPB1: IC7.2(GPB1) SSW2.8(SS)
GPIO1-1: U1.33
GPIO1-2: U1.34
GPIO2-1: U1.38
GPIO2-2: U1.39
GPIO3-1: U1.40
GPIO3-2: U1.41
I2C_SCL: IC1.12(SCL) IC2.26(SCL) IC3.26(SCL) IC4.26(SCL) IC5.26(SCL) IC6.12(SCL) IC7.12(SCL) IC8.12(SCL) R5.1 SERIAL1.4 SERIAL2.4 SERIAL3.4 U1.21(21(SCL))
I2C_SDA: IC1.13(SDA) IC2.27(SDA) IC3.27(SDA) IC4.27(SDA) IC5.27(SDA) IC6.13(SDA) IC7.13(SDA) IC8.13(SDA) R6.1 SERIAL1.3 SERIAL2.3 SERIAL3.3 U1.20(20(SDA))
L0: B1.P$2(K1) B1ALT.P$2(K1) R23.1
L1: B1.P$3(K2) B1ALT.P$3(K2) R22.1
L2: B2.P$2(K1) B2ALT.P$2(K1) R21.1
L3: B2.P$3(K2) B2ALT.P$3(K2) R20.1
L4: B3.P$2(K1) B3ALT.P$2(K1) R19.1
L5: B3.P$3(K2) B3ALT.P$3(K2) R18.1
L6: B4.P$2(K1) B4ALT.P$2(K1) R17.1
L7: B4.P$3(K2) B4ALT.P$3(K2) R16.1
L8: B5.P$2(K1) B5ALT.P$2(K1) R15.1
L9: B5.P$3(K2) B5ALT.P$3(K2) R14.1
L10: B6.P$2(K1) B6ALT.P$2(K1) R13.1
L11: B6.P$3(K2) B6ALT.P$3(K2) R12.1
L12: B7.P$2(K1) B7ALT.P$2(K1) R11.1
L13: B7.P$3(K2) B7ALT.P$3(K2) R10.1
L14: B8.P$2(K1) B8ALT.P$2(K1) R4.1
L15: B8.P$3(K2) B8ALT.P$3(K2) R3.1
L16: B9.P$2(K1) B9ALT.P$2(K1) R39.1
L17: B9.P$3(K2) B9ALT.P$3(K2) R38.1
L18: B10.P$2(K1) B10ALT.P$2(K1) R37.1
L19: B10.P$3(K2) B10ALT.P$3(K2) R36.1
L20: B11.P$2(K1) B11ALT.P$2(K1) R35.1
L21: B11.P$3(K2) B11ALT.P$3(K2) R34.1
L22: B12.P$2(K1) B12ALT.P$2(K1) R33.1
L23: B12.P$3(K2) B12ALT.P$3(K2) R32.1
L24: B13.P$2(K1) R31.1
L25: B13.P$3(K2) R30.1
L26: B14.P$2(K1) B14ALT.P$2(K1) R29.1
L27: B14.P$3(K2) B14ALT.P$3(K2) R28.1
L28: B15.P$2(K1) R27.1
L29: B15.P$3(K2) R26.1
L30: B16.P$2(K1) R25.1
L31: B16.P$3(K2) R24.1
L32: B17.P$2(K1) B17ALT.P$2(K1) R55.1
L33: B17.P$3(K2) B17ALT.P$3(K2) R54.1
L34: B18.P$2(K1) R53.1
L35: B18.P$3(K2) R52.1
L36: B19.P$2(K1) R51.1
L37: B19.P$3(K2) R50.1
L38: B20.P$2(K1) B20ALT.P$2(K1) R49.1
L39: B20.P$3(K2) B20ALT.P$3(K2) R48.1
L40: B21.P$2(K1) B21ALT.P$2(K1) R47.1
L41: B21.P$3(K2) B21ALT.P$3(K2) R46.1
L42: B22.P$2(K1) R45.1
L43: B22.P$3(K2) R44.1
L44: B23.P$2(K1) R43.1
L45: B23.P$3(K2) R42.1
L46: B24.P$2(K1) R41.1
L47: B24.P$3(K2) R40.1
L48: B25.P$2(K1) R71.1
L49: B25.P$3(K2) R70.1
L50: B26.P$2(K1) B26ALT.P$2(K1) R69.1
L51: B26.P$3(K2) B26ALT.P$3(K2) R68.1
L52: B27.P$2(K1) B27ALT.P$2(K1) R67.1
L53: B27.P$3(K2) B27ALT.P$3(K2) R66.1
L54: B28.P$2(K1) R65.1
L55: B28.P$3(K2) R64.1
L56: B29.P$2(K1) R63.1
L57: B29.P$3(K2) R62.1
L58: B30.P$2(K1) R61.1
L59: B30.P$3(K2) R60.1
MOSI: C2.1 R2.1 SERIAL1.8 SERIAL2.8 SERIAL3.8 SSW1.6(SDI) SSW2.6(SDI)
N$1 [Power]: L2.1 SERIAL2.2
N$2: R56.2 R58.1 SW1.B U$66.2
N$3 [Power]: L1.2 SJ1.2 SJ2.1
N$4: IC2.13(L7) R16.2
N$5: IC2.12(L6) R17.2
N$6: IC2.11(L5) R18.2
N$7 [Power]: JOYSTICKS.7 L6.2
N$8: IC2.10(L4) R19.2
N$9: SJ2.2 UART1.9
N$10: SJ1.1 UART1.10
N$11: R1.2 U1.48
N$12: IC2.9(L3) R20.2
N$13: IC2.8(L2) R21.2
N$14: R2.2 U1.49
N$15: R7.1 U$1.A3
N$16: IC2.7(L1) R22.2
N$17: R8.1 U$1.A2
N$18: U1.53
N$19: U1.52
N$20: U1.51
N$21: U1.50
N$22: IC2.6(L0) R23.2
N$23: IC2.15(L8) R15.2
N$24: U1.47
N$25: U1.46
N$26: U1.45
N$27: U1.44
N$28: U1.43
N$29: U1.42
N$30: IC2.16(L9) R14.2
N$31: IC2.17(L10) R13.2
N$32: IC2.18(L11) R12.2
N$33: IC2.19(L12) R11.2
N$34: IC2.20(L13) R10.2
N$35: IC2.21(L14) R4.2
N$36: IC2.22(L15) R3.2
N$37: IC3.13(L7) R32.2
N$38: IC3.12(L6) R33.2
N$39: IC3.11(L5) R34.2
N$40: IC3.10(L4) R35.2
N$41: IC3.9(L3) R36.2
N$42: IC3.8(L2) R37.2
N$43: IC3.7(L1) R38.2
N$44: IC3.6(L0) R39.2
N$45: IC3.15(L8) R31.2
N$46: IC3.16(L9) R30.2
N$47: IC3.17(L10) R29.2
N$48: IC3.18(L11) R28.2
N$49: IC3.19(L12) R27.2
N$50: IC3.20(L13) R26.2
N$51: IC3.21(L14) R25.2
N$52: IC3.22(L15) R24.2
N$53: IC4.13(L7) R48.2
N$54: IC4.12(L6) R49.2
N$55: IC4.11(L5) R50.2
N$56: IC4.10(L4) R51.2
N$57: IC4.9(L3) R52.2
N$58: IC4.8(L2) R53.2
N$59: IC4.7(L1) R54.2
N$60: IC4.6(L0) R55.2
N$61: IC4.15(L8) R47.2
N$62: IC4.16(L9) R46.2
N$63: IC4.17(L10) R45.2
N$64: IC4.18(L11) R44.2
N$65: IC4.19(L12) R43.2
N$66: IC4.20(L13) R42.2
N$67: IC4.21(L14) R41.2
N$68: IC4.22(L15) R40.2
N$69: IC5.13(L7) R64.2
N$70: IC5.12(L6) R65.2
N$71: IC5.11(L5) R66.2
N$72: IC5.10(L4) R67.2
N$73: IC5.9(L3) R68.2
N$74: IC5.8(L2) R69.2
N$75: IC5.7(L1) R70.2
N$76: IC5.6(L0) R71.2
N$77: IC5.15(L8) R63.2
N$78: IC5.16(L9) R62.2
N$79: IC5.17(L10) R61.2
N$80: IC5.18(L11) R60.2
N$124: C24.1 IC9.13(A:I) R56.1
RESET: RESET.3 RESETA.3 U1.RESET
RXD1: U1.19(19(RX1)) UART1.2
RXD2: U1.17(17(RX2))
RXD3: U1.15(15(RX3))
SCLK: C1.1 R1.1 SERIAL1.7 SERIAL2.7 SERIAL3.7 SSW1.7(SCK) SSW2.7(SCK)
SW1: JOYSTICKS.1 U1.35
SW2: JOYSTICKS.4 U1.36
TXD1: U1.18(18(TX1)) UART1.3
TXD2: U1.16(16(TX2))
TXD3: U1.14(14(TX3))
VIN [Power]: U1.VIN
Unconnected: IC1.19(INTB) IC1.20(INTA) IC5.19(L12) IC5.20(L13) IC5.21(L14) IC5.22(L15) IC6.19(INTB) IC6.20(INTA) IC7.3(GPB2) IC7.4(GPB3) IC7.5(GPB4) IC7.6(GPB5) IC7.7(GPB6) IC7.8(GPB7) IC7.19(INTB) IC7.20(INTA) IC7.23(GPA2) IC7.24(GPA3) IC7.25(GPA4) IC7.26(GPA5) IC7.27(GPA6) IC7.28(GPA7) IC8.2(GPB1) IC8.3(GPB2) IC8.4(GPB3) IC8.5(GPB4) IC8.6(GPB5) IC8.7(GPB6) IC8.8(GPB7) IC8.19(INTB) IC8.20(INTA) IC8.23(GPA2) IC8.24(GPA3) IC8.25(GPA4) IC8.26(GPA5) IC8.27(GPA6) IC8.28(GPA7) IC9.2(D:O) IC9.4(E:O) IC9.6(F:O) IC9.8(C:O) IC9.10(B:O) JP1.1 JP1.2 JP2.1 JP2.2 SERIAL1.6 SERIAL2.6 SERIAL3.6 SSW1.5(SDO) SSW2.5(SDO) SW1.GND1(G) SW1.GND2(G) U1.0(0(RX0)) U1.1(1(TX0)) U1.2 U1.3 U1.3.3V U1.4 U1.5 U1.10 U1.11 U1.12 U1.13 U1.AREF U$34.A1 UART1.1 UART1.4 UART1.6 UART1.7 UART1.8

### Notes on the sheet
- ADR=B100x01
- ADR=Bx01
- ADR=B111x01
- ENCODER
- ADR=B100x00
- ADR=Bx11
- BUTTONS | LED DRIVER | INPUT/GPIO
- ADR=Bx00
- ADR=B111x00
- CONFIG
- POWER
- SLIDER
- BUTTONS | INPUT/GPIO
- ADR=Bx10
- POWER
- SERIAL BUS
- SERIAL BUS
- RESET: | CONF:
- (SLIDER/T-BAR IN) | (SLIDER/T-BAR IN)
- (SLIDER/T-BAR IN) | (SLIDER/T-BAR IN)
- I2C Pull Up Resistors
- JOYSTICKS | ANALOG DAISY (Main)

## Sheet 2 of 2

## Library data of the parts
ANLGDAISY-MAIN JOYSTICKS SERIAL2 = SparkFun:M04X2
B1 B1ALT B2 B2ALT B3 B3ALT B4 B4ALT B5 B5ALT B6 B6ALT B7 B7ALT B8 B8ALT B9 B9ALT B10 B10ALT B11 B11ALT B12 B12ALT B13 B14 B14ALT B15-B17 B17ALT B18-B20 B20ALT B21 B21ALT B22-B26 B26ALT B27 B27ALT B28-B30 = SKAARHOJ:LP11-B
C1-C27 C30 = SparkFun:CAP: Capacitor Standard 0603 ceramic capacitor, and 0.1" leaded capacitor.
CONF RESET RESETA = SKAARHOJ:TAC_SWITCH: Momentary Switch Button commonly used for reset or general input. Spark Fun Electronics SKU : COM-00097
CONF-A1 SJ1 SJ2 = SparkFun:SOLDERJUMPER: Solder Jumper Standard SMD solder jumper. Used to automate production. Two varients : Normally Open and Normally Closed are the same, but have different paste layers. NC will have a large amount of paste and should jumper during reflow.
IC1 IC6-IC8 = microchip:MCP23017: http://ww1.microchip.com/downloads/en/DeviceDoc/21952a.pdf Source: http://ww1.microchip.com/downloads/en/DeviceDoc/21952a.pdf; MF: MICROCHIP; MPN: MCP23017-E/SS; OC_FARNELL: 1467674; OC_NEWARK: 31K2960
IC2-IC5 = wsmith:PCA9685
IC9 = 74xx-eu:74*14: Hex schmitt trigger INVERTER
JP1 JP2 = SparkFun:M02: Header 2 Standard 2-pin 0.1" header. Use with straight break away headers (SKU : PRT-00116), right angle break away headers (PRT-00553), swiss pins (PRT-00743), machine pins (PRT-00117), and female headers (PRT-00115). Molex polarized connector foot print use with SKU : PRT-08233 with associated crimp pins and housings.
JP3 JP4 = SparkFun:M04: Header 4 Standard 4-pin 0.1" header. Use with straight break away headers (SKU : PRT-00116), right angle break away headers (PRT-00553), swiss pins (PRT-00743), machine pins (PRT-00117), and female headers (PRT-00115). Molex polarized connector foot print use with SKU : PRT-08231 with associated crimp pins and housings. 1MM SMD Version SKU: PRT-10208
L1-L3 L6 = SparkFun:INDUCTOR: Inductors Basic Inductor/Choke - 0603 and 1206. Footprints are not proven and vary greatly between part numbers.
PC2 = rcl:CPOL-EU: POLARIZED CAPACITOR, European symbol
POT1 = SKAARHOJ:SLIDER
R1-R56 R58 R60-R71 = SparkFun:RESISTOR: Resistor Basic schematic elements and footprints for 0603, 1206, and PTH resistors.
SERIAL1 SERIAL3 = SparkFun:M08: Header 8 Standard 8-pin 0.1" header. Use with straight break away headers (SKU : PRT-00116), right angle break away headers (PRT-00553), swiss pins (PRT-00743), machine pins (PRT-00117), and female headers (PRT-00115).
SSW1 SSW2 = SKAARHOJ:SMART_SWITCH: SMARTSWITCH IS15DSBFP4RGB www.nkksmartswitch.com
SW1 = switch-alps:EC12E_SW: ALPS rotary Encoder EC12E series with switch; MPN: EC12E2424407; OC_FARNELL: 1520813; OC_NEWARK: 74M1068
U1 = SKAARHOJ:ARDUINO-MEGA: Arduino Mega footprint connections
U$1 = SKAARHOJ:LEDBICOLOR-AKA
U$7 U$15 U$18 U$20 U$21 = SKAARHOJ:GNDPAD
U$34 = SKAARHOJ:2BITADDR
U$66 = SKAARHOJ:M02X2
UART1 = SparkFun:M05X2: Header 5x2 Standard 10-pin dual row 0.1" header. Commonly used with AVR-ISP. Use with Spark Fun Electronics SKU: PRT-00778

## Net classes
0 default: width 0.203 mm, drill 0.406 mm, clearance 0.203 mm
1 Power: width 0.356 mm, drill 0.508 mm, clearance 0.203 mm